# Altium schematic sheet main.SchDoc
size A3
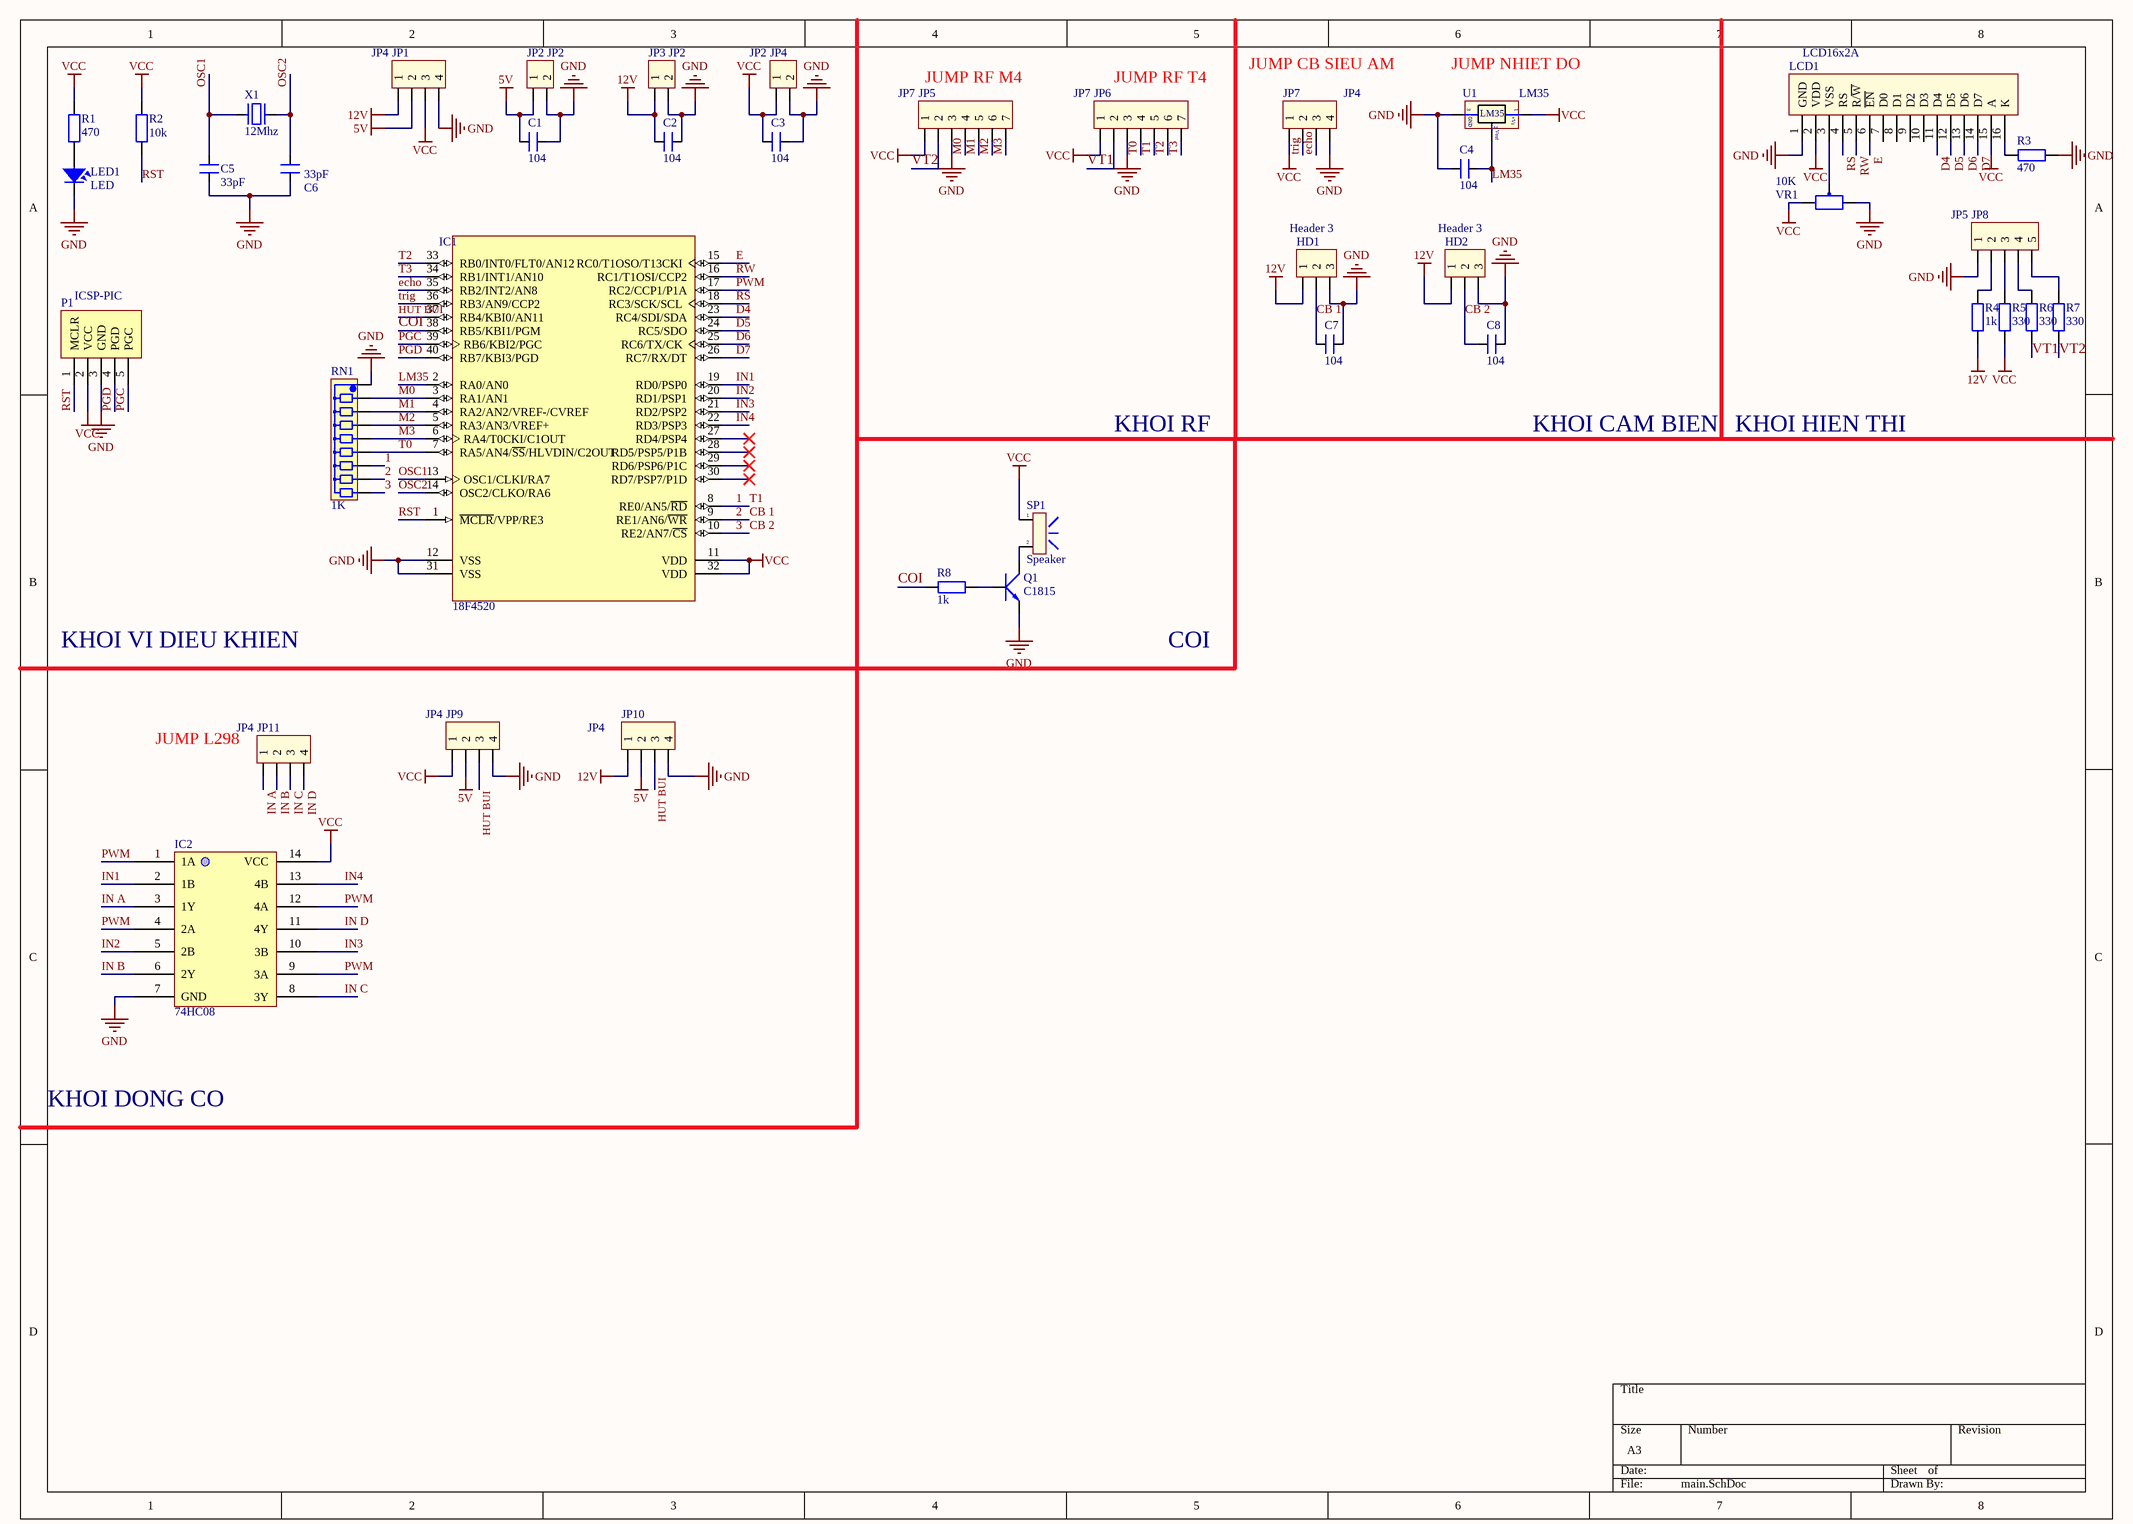
[diagram p0: main.SchDoc]

## Parts
C1  104  [CN2]
C2  104  [CN2]
C3  104  [CN2]
C4  104  [CN2]
C5  33pF  [CN1]
C6  33pF  [CN1]
C7  104  [CN2]
C8  104  [CN2]
HD1  Header 3  [HED3]
HD2  Header 3  [HED3]
IC1  18F4520  [DIP40/W0.6]
IC2  74HC08  [DIP14/W0.3]
JP1  JP4  [CON4]
JP2  JP2  [CON2]
JP3  JP2  [CON2]
JP4  JP2  [CON2]
JP5  JP7  [CON7]
JP6  JP7  [CON7]
JP7  JP4  [CON4]
JP8  JP5  [CON5]
JP9  JP4  [CON4]
JP10  JP4  [CON4]
JP11  JP4  [CON4]
LCD1  LCD16x2A  [LCD16X2]
LED1  LED  [LED-3]
P1  ICSP-PIC  [HDR1X5]
Q1  C1815  [QTO-92]
R1  470  [R1/4W]
R2  10k  [R1/4W]
R3  470  [R1/4W]
R4  1k  [R1/4W]
R5  330  [R1/4W]
R6  330  [R1/4W]
R7  330  [R1/4W]
R8  1k  [R1/4W]
RN1  1K  [RN8]
SP1  Speaker  [SPK]
U1  LM35  [QTO-92]
VR1  10K  [VR1]
X1  12Mhz  [XT2]

## Nets
5V: C1.1 JP1.2 JP2.1 JP9.2 JP10.2
12V: C2.1 HD1.1 HD2.1 JP1.1 JP3.1 JP10.1 R4.1
GND: C1.2 C2.2 C3.2 C4.2 C5.2 C6.2 C7.2 C8.2 HD1.3 HD2.3 IC1.12(VSS) IC1.31(VSS) IC2.7(GND) JP1.4 JP2.2 JP3.2 JP4.2 JP5.3 JP6.3 JP7.4 JP8.1 JP9.4 JP10.4 LCD1.1(GND) LED1.2 P1.3(GND) Q1.1(E) R3.1 RN1.1 U1.3(-) VR1.3
VCC: C3.1 IC1.11(VDD) IC1.32(VDD) IC2.14(VCC) JP1.3 JP4.1 JP5.1 JP6.1 JP7.1 JP9.1 LCD1.2(VDD) LCD1.15(A) P1.2(VCC) R1.1 R2.2 R5.1 SP1.1 U1.1(+Vs) VR1.1
1: IC1.8(RE0/AN5/~{RD}) JP6.5 RN1.7  [also labelled T1]
2: C7.1 HD1.2 IC1.9(RE1/AN6/~{WR}) RN1.8  [also labelled CB 1]
3: C8.1 HD2.2 IC1.10(RE2/AN7/~{CS}) RN1.9  [also labelled CB 2]
COI: IC1.38(RB5/KBI1/PGM) R8.1
D4: IC1.23(RC4/SDI/SDA) LCD1.11(D4)
D5: IC1.24(RC5/SDO) LCD1.12(D5)
D6: IC1.25(RC6/TX/CK) LCD1.13(D6)
D7: IC1.26(RC7/RX/DT) LCD1.14(D7)
E: IC1.15(RC0/T1OSO/T13CKI) LCD1.6(~{EN})
echo: IC1.35(RB2/INT2/AN8) JP7.3
HUT BUI: IC1.37(RB4/KBI0/AN11) JP9.3 JP10.3
IN1: IC1.19(RD0/PSP0) IC2.2(1B)
IN2: IC1.20(RD1/PSP1) IC2.5(2B)
IN3: IC1.21(RD2/PSP2) IC2.10(3B)
IN4: IC1.22(RD3/PSP3) IC2.13(4B)
IN A: IC2.3(1Y) JP11.1
IN B: IC2.6(2Y) JP11.2
IN C: IC2.8(3Y) JP11.3
IN D: IC2.11(4Y) JP11.4
LM35: C4.1 IC1.2(RA0/AN0) U1.2(Vout)
M0: IC1.3(RA1/AN1) JP5.4 RN1.2
M1: IC1.4(RA2/AN2/VREF-/CVREF) JP5.5 RN1.3
M2: IC1.5(RA3/AN3/VREF+) JP5.6 RN1.4
M3: IC1.6(RA4/T0CKI/C1OUT) JP5.7 RN1.5
OSC1: C5.1 IC1.13(OSC1/CLKI/RA7) X1.2
OSC2: C6.1 IC1.14(OSC2/CLKO/RA6) X1.1
PGC: IC1.39(RB6/KBI2/PGC) P1.5(PGC)
PGD: IC1.40(RB7/KBI3/PGD) P1.4(PGD)
PWM: IC1.17(RC2/CCP1/P1A) IC2.1(1A) IC2.4(2A) IC2.9(3A) IC2.12(4A)
RS: IC1.18(RC3/SCK/SCL) LCD1.4(RS)
RST: IC1.1(~{MCLR}/VPP/RE3) P1.1(MCLR) R2.1
RW: IC1.16(RC1/T1OSI/CCP2) LCD1.5(R/~{W})
T0: IC1.7(RA5/AN4/~{SS}/HLVDIN/C2OUT) JP6.4 RN1.6
T2: IC1.33(RB0/INT0/FLT0/AN12) JP6.6
T3: IC1.34(RB1/INT1/AN10) JP6.7
trig: IC1.36(RB3/AN9/CCP2) JP7.2
VT1: JP6.2 R6.1
VT2: JP5.2 R7.1
NetJP8_2: JP8.2 R4.2
NetJP8_3: JP8.3 R5.2
NetJP8_4: JP8.4 R6.2
NetJP8_5: JP8.5 R7.2
NetLCD1_3: LCD1.3(VSS) VR1.2
NetLCD1_16: LCD1.16(K) R3.2
NetLED1_1: LED1.1 R1.2
NetQ1_2: Q1.2(C) SP1.2
NetQ1_3: Q1.3(B) R8.2

Not connected (* = marked no-connect by the designer): IC1 27(RD4/PSP4)* 28(RD5/PSP5/P1B)* 29(RD6/PSP6/P1C)* 30(RD7/PSP7/P1D)*; LCD1 7(D0) 8(D1) 9(D2) 10(D3)

## Notes on the sheet
- (near JP5) JUMP RF M4
- (near JP6) JUMP RF T4
- JUMP CB SIEU AM
- (near U1) JUMP NHIET DO
- KHOI RF
- KHOI CAM BIEN
- KHOI HIEN THI
- KHOI VI DIEU KHIEN
- COI
- (near JP11) JUMP L298
- KHOI DONG CO
- (in symbol LM35) GND

## Library data of the parts
C1-C4 C7 C8 = CN2: Cap np 104 => 105pF; Value: 0.1uF; Description: Cap np Cremic Value  104pF => 105pF
C5 C6 = CN1: Cap np  1pF - 472pF; Value: 100pF; Description: Cap np Cremic Value  1pF => 472 pF
HD1 HD2 = Hed3: Header 3 (Green); Value: Header 3
IC1 = 18F4520: 32KB Flash, 1536B RAM, 256B EFROM, 40-Pin PDIP; Value: DIP 40; Value: 18F4520; Copyright by: VanDungEvn
JP1 JP7 JP9-JP11 = Con4: Connector 4; Value: Connector 4
JP2-JP4 = Con2: Connector 2; Value: Connector 2
JP5 JP6 = Con7: Connector 7; Value: Connector 7
JP8 = Con5: Connector 5; Value: Connector 5
LCD1 = LCD16x2: LCD dipslay 16 char, 2 line; Value: LCD16x2A
LED1 = LED: LED Single colour Green and Red; Value: LED 3 ly Single Colour; Description: LED 5 ly Single Colour; Description: Led  Vuong
P1 = ICSP-PIC: Header, 5-Pin; LatestRevisionDate: 17-Jul-2002; LatestRevisionNote: Re-released for DXP Platform.; Publisher: Altium Limited
Q1 = C1815: NPN 600mW, ECB; Value: C1815
R1-R8 = R1/4W: Resistor 1/4W; Value: R1/4W - 1K
RN1 = RN8: Resistor 8 (Thanh); Value: Tro thanh 10K
SP1 = SPK: Speaker Chip; Value: Speaker Chip
U1 = LM35: Teminal; Value: LM35
VR1 = VR: Var Resistor; Value: VR 10K
X1 = XT2: Crystal For all Crystal 2pin.; Value: 4Mhz